# Altium schematic sheet power.SchDoc
size A4
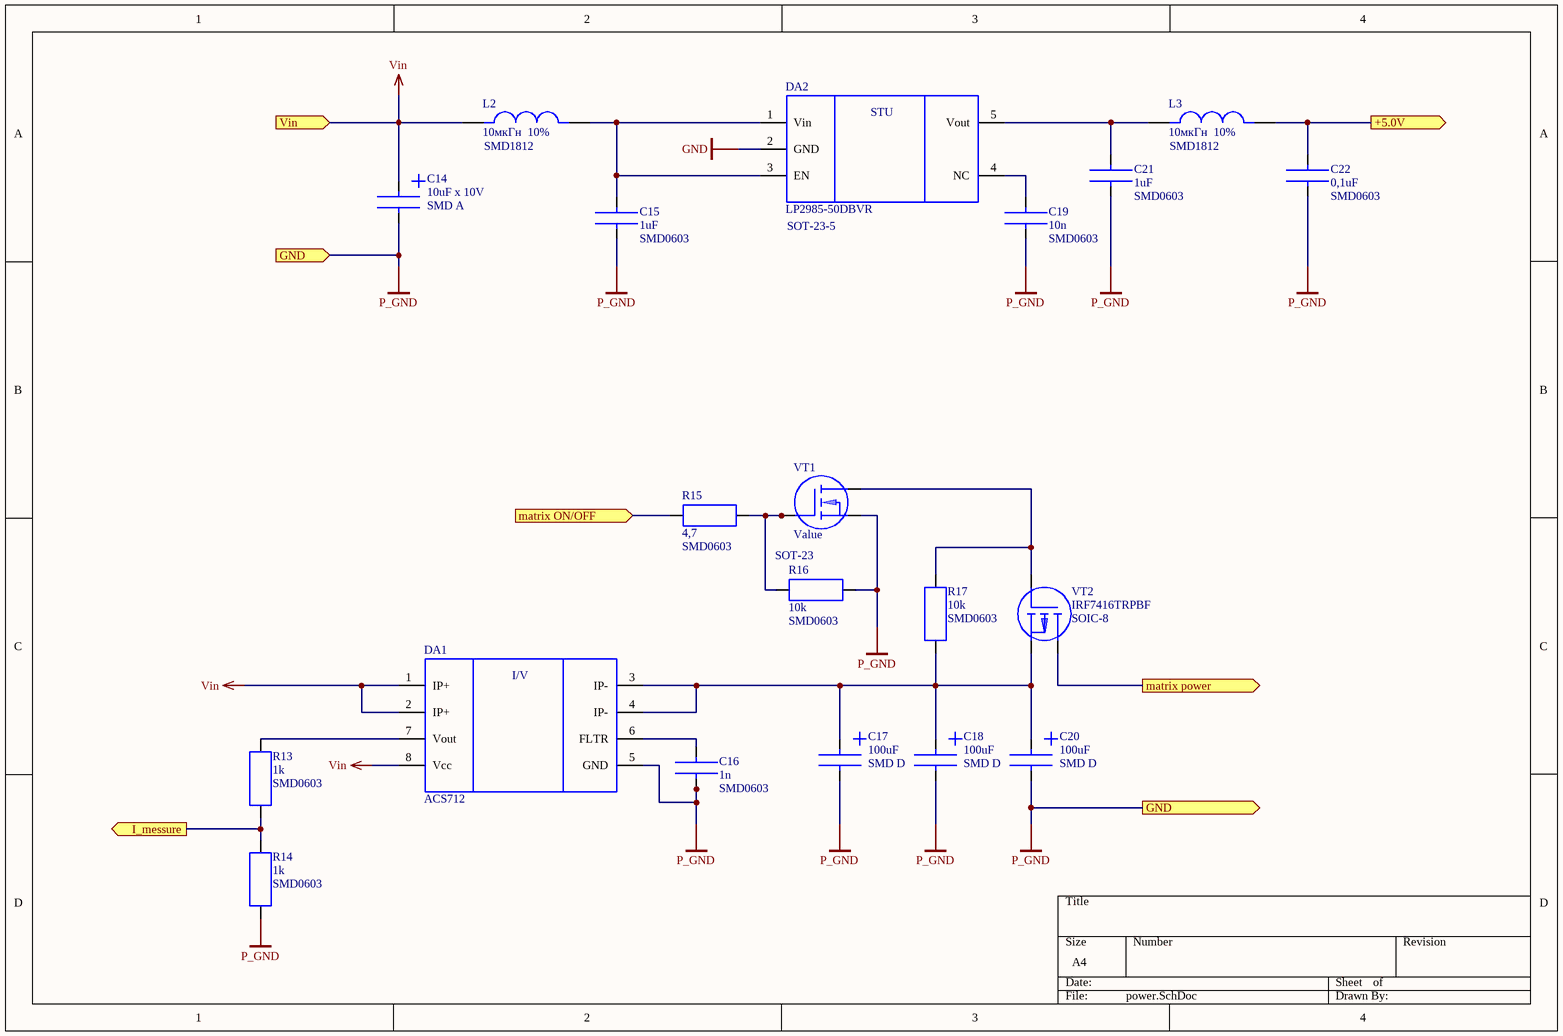
[diagram p0: power.SchDoc]

## Parts
C14  10uF x 10V  Package: SMD A  [TANT_CAP_A(3216)]
C15  1uF  Package: SMD0603  [SMD0603(1005)]
C16  1n  Package: SMD0603  [SMD0603(1005)]
C17  100uF  Package: SMD D  [TANT_CAP_D(7343)]
C18  100uF  Package: SMD D  [TANT_CAP_D(7343)]
C19  10n  Package: SMD0603  [SMD0603(1005)]
C20  100uF  Package: SMD D  [TANT_CAP_D(7343)]
C21  1uF  Package: SMD0603  [SMD0603(1005)]
C22  0,1uF  Package: SMD0603  [SMD0603(1005)]
DA1  ACS712  [SOIC8]
DA2  LP2985-50DBVR  Package: SOT-23-5  [SOT23-5]
L2  10мкГн  10%  Package: SMD1812  [SMD2010(5025)]
L3  10мкГн  10%  Package: SMD1812  [SMD2010(5025)]
R13  1k  Package: SMD0603  [SMD0603(1005)]
R14  1k  Package: SMD0603  [SMD0603(1005)]
R15  4,7  Package: SMD0603  [SMD0603(1005)]
R16  10k  Package: SMD0603  [SMD0603(1005)]
R17  10k  Package: SMD0603  [SMD0603(1005)]
VT1  Value  Package: SOT-23  [SOT23-3]
VT2  IRF7416TRPBF  Package: SOIC-8  [VT_SOIC8]

## Ports
+5.0V (out), GND (in), GND (out), I_messure (out), matrix ON/OFF (in), matrix power (out), Vin (in)

## Nets
GND: DA2.2(GND)
P_GND: C14.2 C15.2 C16.2 C17.2 C18.2 C19.2 C20.2 C21.2 C22.2 DA1.5(GND) R14.2 R16.2 VT1.2 ; port GND
Vin: C14.1 DA1.1(IP+) DA1.2(IP+) DA1.8(Vcc) L2.1(IN1) ; port Vin
+5.0V: C22.1 L3.2(IN1) ; port +5.0V
I_messure: R13.2 R14.1 ; port I_messure
matrix ON/OFF: R15.1 ; port matrix ON/OFF
matrix power: VT2.3 ; port matrix power
NetC15_1: C15.1 DA2.1(Vin) DA2.3(EN) L2.2(IN1)
NetC16_1: C16.1 DA1.6(FLTR)
NetC17_1: C17.1 C18.1 C20.1 DA1.3(IP-) DA1.4(IP-) R17.2 VT2.1
NetC19_1: C19.1 DA2.4(NC)
NetC21_1: C21.1 DA2.5(Vout) L3.1(IN1)
NetDA1_7: DA1.7(Vout) R13.1
NetR15_2: R15.2 R16.1 VT1.1
NetR17_1: R17.1 VT1.3 VT2.2

## Notes on the sheet
- (in symbol LD3985M33R) STU
- (in symbol Микросхема ACS712) I/V

## Library data of the parts
C14 = C_TANT_A: Type: C; ValueBOM: Конденсатор танталовый 10мкФ х 10В SMD A; Value: 10uF x 10V
C15 C21 = CER_CUP_0603: Type: C; ValueBOM: Конденсатор керамический 1мкФ SMD 0603 1%; Value: 1uF
C16 = CER_CUP_0603: Type: C; ValueBOM: Конденсатор керамический 1нФ х 50В SMD 0603 1%; Value: 1n
C17 C18 C20 = C_TANT_D: Type: C; ValueBOM: Конденсатор танталовый 100мкФ х 16В 10%  SMD D; Value: 100uF
C19 = CER_CUP_0603: Type: C; ValueBOM: Конденсатор керамический 10нФ х 50В SMD 0603 1%; Value: 10n
C22 = CER_CUP_0603: Type: C; ValueBOM: Конденсатор керамический 0,1мкФ SMD 0603 1%; Value: 0,1uF
DA1 = Микросхема ACS712: Value: ACS712; Type: DA; ValueBOM: Микросхема ACS712
DA2 = LD3985M33R: ValueBOM: Микросхема LP2985-50DBVR, SOT-23-5; Value: LP2985-50DBVR; Type: DA
L2 L3 = L1: ValueBOM: Индуктивность B82432-C1103-K, 10 мкГн, SMD1812, 10%; Type: L; Value: 10мкГн  10%
R13 R14 = R_0603: ValueBOM: Резистор 1кОм SMD 0603 1%; Type: R; Value: 1k
R15 = R_0603: ValueBOM: Резистор 4,7Ом SMD 0603 1%; Type: R; Value: 4,7
R16 R17 = R_0603: ValueBOM: Резистор 10кОм SMD 0603 1%; Type: R; Value: 10k
VT1 = VT_N_MOSFET_SOT23_3: Type: VT; ValueBOM: Транзистор n-МОП Value SOT23; Value: Value
VT2 = Транзистор IRF7416TRPBF: Type: VT; ValueBOM: Транзистор p-МОП IRF7416TRPBF, SOIC-8; Value: IRF7416TRPBF